# EAGLE design LPC_smd_display_vert (EAGLE 5.03)
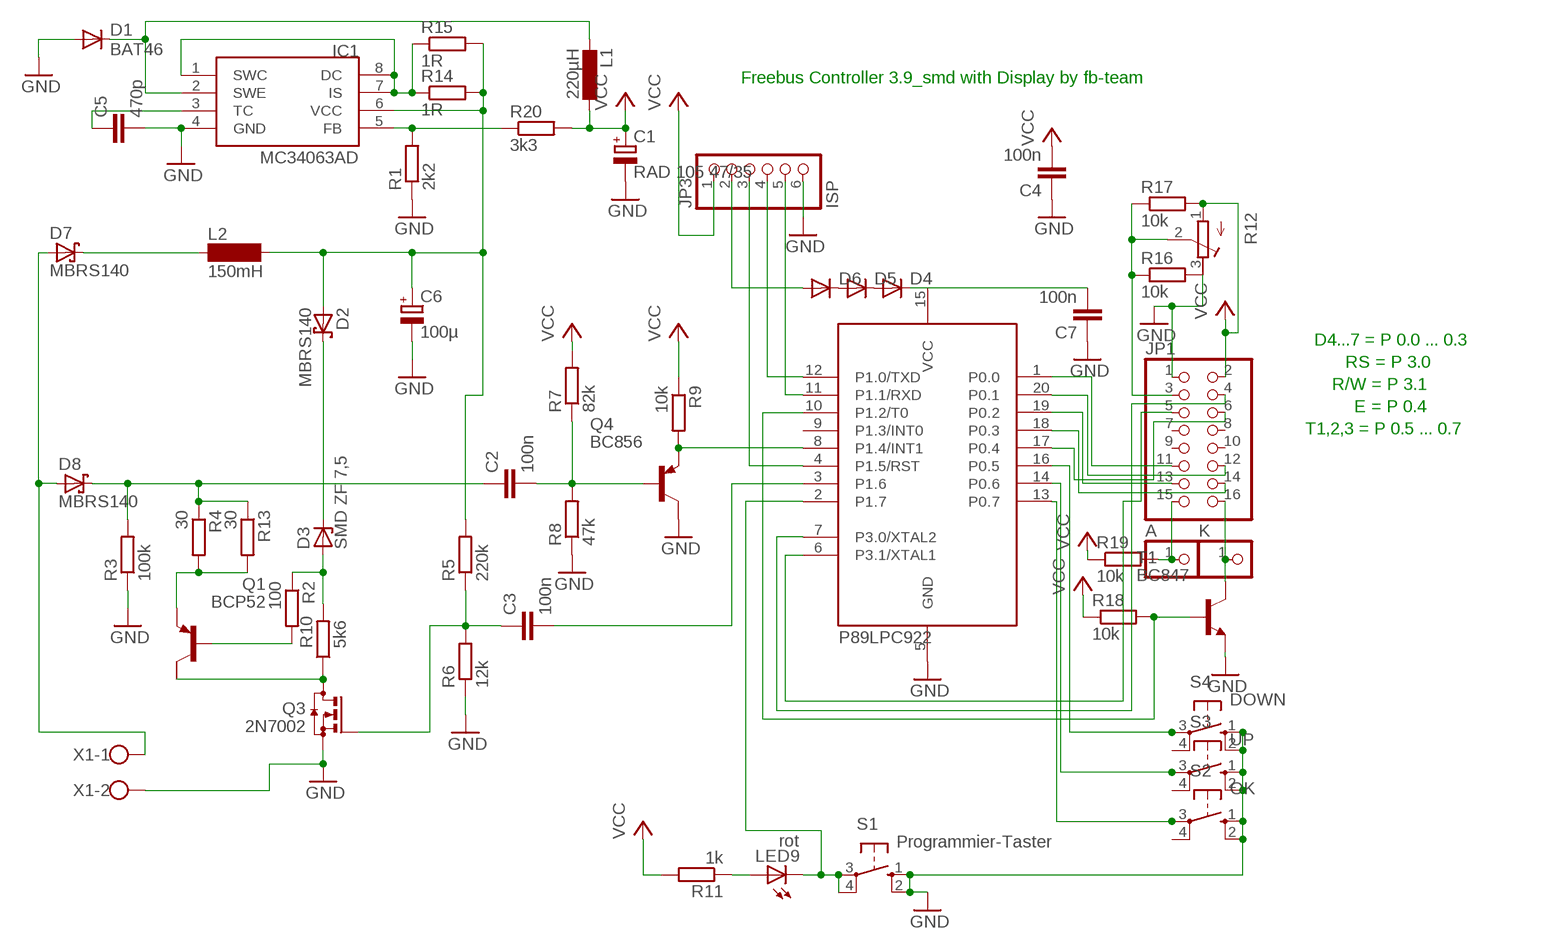
[diagram p0: schematic, sheet 1]

## Parts
A  PINHD-1X1  [1X01]
C1  RAD 105 47/35  CPOL-EUE2-5  [E2-5]
C2  100n  C-EUC1206  [C1206]
C3  100n  C-EUC1206  [C1206]
C4  100n  C-EUC1206  [C1206]
C5  470p  C-EUC1206  [C1206]
C6  100µ  CPOL-EUE2.5-7  [E2,5-7]
C7  100n  C-EUC1206  [C1206]
D1  BAT46  DIODE-MINIMELF  [MINIMELF]
D2  MBRS140  MBRS130LT3  [SMB]
D3  SMD ZF 7,5  ZPD  [MINIMELF]
D4  DIODE-MINIMELF  [MINIMELF]
D5  DIODE-MINIMELF  [MINIMELF]
D6  DIODE-MINIMELF  [MINIMELF]
D7  MBRS140  MBRS130LT3  [SMB]
D8  MBRS140  MBRS130LT3  [SMB]
IC1  MC34063AD  [SOIC8]
JP1  PINHD-2X8  [2X08]
JP3  ISP  PINHD-1X6  [1X06]
K  PINHD-1X1  [1X01]
L1  220µH  L-EU2200-11.43  [2200-11.43]
L2  150mH  SD12-1000  [SD12_1000]
LED9  rot  LED3MM  [LED3MM]
Q1  BCP52  FZT753SMD  [SOT223]
Q3  2N7002  BSS123  [SOT23]
Q4  BC856  BC856ALT1SMD  [SOT23-BEC]
R1  2k2  R-EU_R1206  [R1206]
R2  100  R-EU_M1206  [M1206]
R3  100k  R-EU_M1206  [M1206]
R4  30  R-EU_R1206  [R1206]
R5  220k  R-EU_R1206  [R1206]
R6  12k  R-EU_M1206  [M1206]
R7  82k  R-EU_R1206  [R1206]
R8  47k  R-EU_M1206  [M1206]
R9  10k  R-EU_R1206  [R1206]
R10  5k6  R-EU_M1206  [M1206]
R11  1k  R-EU_M1206  [M1206]
R12  R-TRIMM3374  [RTRIM3374]
R13  30  R-EU_R1206  [R1206]
R14  1R  R-EU_M1206  [M1206]
R15  1R  R-EU_M1206  [M1206]
R16  10k  R-EU_R1206  [R1206]
R17  10k  R-EU_R1206  [R1206]
R18  10k  R-EU_R1206  [R1206]
R19  10k  R-EU_R1206  [R1206]
R20  3k3  R-EU_M1206  [M1206]
S1  Programmier-Taster  10-XX  [B3F-10XX]
S2  OK  10-XX  [B3F-10XX]
S3  UP  10-XX  [B3F-10XX]
S4  DOWN  10-XX  [B3F-10XX]
T1  BC847  [SOT23]
U$1  P89LPC922_SMD  [SO20W]
X1  W237-02P  [W237-132]

## Nets
GND: C1.- C4.1 C5.2 C6.- C7.1 D1.A IC1.4(GND) JP1.1 JP3.6 Q3.2(S) Q4.C R1.1 R3.1 R6.1 R8.1 R12.3(A) R16.2 S1.1(S) S1.2(S1) S2.1(S) S2.2(S1) S3.1(S) S3.2(S1) S4.1(S) S4.2(S1) T1.2(E) U$1.5(GND) X1.2
N$1: Q4.E R9.2 U$1.8(P1.4/INT1)
N$2: C2.2 Q4.B R7.1 R8.2
N$3: IC1.5(FB) R1.2 R20.1
N$4: IC1.1(SWC) IC1.7(IS) IC1.8(DC) R14.1 R15.1
N$5: C3.2 U$1.3(P1.6)
N$6: Q1.2(C) Q3.3(D) R10.1
N$7: C6.+ D2.A IC1.6(VCC) L2.2 R5.2 R14.2 R15.2
N$8: D7.C L2.1
N$9: C2.1 D8.C R3.2 R4.1 R13.1
N$10: D1.C IC1.2(SWE) L1.2
N$11: D3.A R2.1 R10.2
N$12: Q1.3(E) R4.2 R13.2
N$13: C5.1 IC1.3(TC)
N$14: Q1.1(B) R2.2
N$15: JP1.11 U$1.1(P0.0)
N$16: D7.A D8.A X1.1
N$17: LED9.K(C) S1.3(P) S1.4(P1) U$1.2(P1.7)
N$18: JP1.12 U$1.20(P0.1)
N$19: JP1.13 U$1.19(P0.2)
N$20: JP1.3 R12.2(S) R16.1 R17.1
N$21: JP1.14 U$1.18(P0.3)
N$22: JP1.16 K.1 T1.3(C)
N$23: S4.3(P) U$1.16(P0.5)
N$24: R18.2 T1.1(B) U$1.10(P1.2/T0)
N$25: JP1.4 U$1.7(P3.0/XTAL2)
N$26: JP1.5 U$1.6(P3.1/XTAL1)
N$27: JP1.6 U$1.17(P0.4)
N$28: S3.3(P) U$1.14(P0.6)
N$29: JP3.4 U$1.12(P1.0/TXD)
N$30: JP3.5 U$1.11(P1.1/RXD)
N$31: JP3.3 U$1.4(P1.5/RST)
N$32: D6.A JP3.2
N$33: S2.3(P) U$1.13(P0.7)
N$34: C3.1 Q3.1(G) R5.1 R6.2
N$35: C7.2 D4.C U$1.15(VCC)
N$36: A.1 JP1.15 R19.2
N$37: D4.A D5.C
N$38: D5.A D6.C
N$40: D2.C D3.C
N$41: LED9.A R11.1
VCC: C1.+ C4.2 JP1.2 JP3.1 L1.1 R7.2 R9.1 R11.2 R12.1(E) R17.2 R18.1 R19.1 R20.2
Unconnected: JP1.7 JP1.8 JP1.9 JP1.10 Q1.4(C/) S2.4(P1) S3.4(P1) S4.4(P1) U$1.9(P1.3/INT0)

## Notes on the sheet
- Freebus Controller 3.9_smd with Display by fb-team
- D4...7 = P 0.0 ... 0.3
- RS = P 3.0
- R/W = P 3.1
- E = P 0.4
- T1,2,3 = P 0.5 ... 0.7
- P89LPC922

## Library data of the parts
A K = pinhead:PINHD-1X1: PIN HEADER
C1 C6 = rcl:CPOL-EU: POLARIZED CAPACITOR, European symbol
C2-C5 C7 = rcl:C-EU: CAPACITOR, European symbol
D1 D4-D6 = diode:DIODE-: DIODE
D2 D7 D8 = diode:MBRS130LT3: Schottky Power Rectifier Source: http://www.onsemi.com/pub/Collateral/MBRS130LT3-D.PDF
D3 = diode:ZPD: Z DIODE 500 mW
IC1 = mc34063:MC34063
JP1 = pinhead:PINHD-2X8: PIN HEADER
JP3 = pinhead:PINHD-1X6: PIN HEADER
L1 = rcl:L-EU: INDUCTOR, European symbol
L2 = inductor-neosid:SD12: INDUCTOR nominal inductance
LED9 = led:LED: LED OSRAM: - CHIPLED LG R971, LG N971, LY N971, LG Q971, LY Q971, LO R971, LY R971 LH N974, LH R974 LS Q976, LO Q976, LY Q976 LO Q996 - Hyper CHIPLED LW Q18S LB Q993, LB Q99A, LB R99A - SideLED LS A670, LO A670, LY A670, LG A670, LP A670 LB A673, LV A673, LT A673, LW A673 LH A674 LY A675 LS A676, LA A676, LO A676, LY A676, LW A676 LS A679, LY A679, LG A679 - Hyper Micro SIDELED® LS Y876, LA Y876, LO Y876, LY Y876 LT Y87S - SmartLED LW L88C, LW L88S LB L89C, LB L89S, LG L890 LS L89K, LO L89K, LY L89K LS L896, LA L896, LO L896, LY L896 - TOPLED LS T670, LO T670, LY T670, LG T670, LP T670 LSG T670, LSP T670, LSY T670, LOP T670, LYG T670 LG T671, LOG T671, LSG T671 LB T673, LV T673, LT T673, LW T673 LH T674 LS T676, LA T676, LO T676, LY T676, LB T676, LH T676, LSB T676, LW T676 LB T67C, LV T67C, LT T67C, LS T67K, LO T67K, LY T67K, LW E67C LS E67B, LA E67B, LO E67B, LY E67B, LB E67C, LV E67C, LT E67C LW T67C LS T679, LY T679, LG T679 LS T770, LO T770, LY T770, LG T770, LP T770 LB T773, LV T773, LT T773, LW T773 LH T774 LS E675, LA E675, LY E675, LS T675 LS T776, LA T776, LO T776, LY T776, LB T776 LHGB T686 LT T68C, LB T68C - Hyper Mini TOPLED® LB M676 - Mini TOPLED Santana® LG M470 LS M47K, LO M47K, LY M47K Source: http://www.osram.convergy.de - LUMILED® LXK2-PW12-R00, LXK2-PW12-S00, LXK2-PW14-U00, LXK2-PW14-V00 LXK2-PM12-R00, LXK2-PM12-S00, LXK2-PM14-U00 LXK2-PE12-Q00, LXK2-PE12-R00, LXK2-PE12-S00, LXK2-PE14-T00, LXK2-PE14-U00 LXK2-PB12-K00, LXK2-PB12-L00, LXK2-PB12-M00, LXK2-PB14-N00, LXK2-PB14-P00, LXK2-PB14-Q00 LXK2-PR12-L00, LXK2-PR12-M00, LXK2-PR14-Q00, LXK2-PR14-R00 LXK2-PD12-Q00, LXK2-PD12-R00, LXK2-PD12-S00 LXK2-PH12-R00, LXK2-PH12-S00 LXK2-PL12-P00, LXK2-PL12-Q00, LXK2-PL12-R00 Source: www.luxeon.com
Q1 = transistor-pnp:FZT753SMD: PNP Transistor
Q3 = transistor-small-signal:BSS123: N-CHANNEL MOS FET
Q4 = transistor-pnp:BC856*: PNP Transistror
R1-R11 R13-R20 = rcl:R-EU_: RESISTOR, European symbol
R12 = rcl:R-TRIMM: Trimm resistor
S1-S4 = switch-omron:10-XX: OMRON SWITCH
T1 = transistor:BC847: NPN TRANSISTOR
U$1 = micro-philips:P89LPC922_SMD
X1 = con-wago-508:W237-02P: WAGO SREW CLAMP

## Board
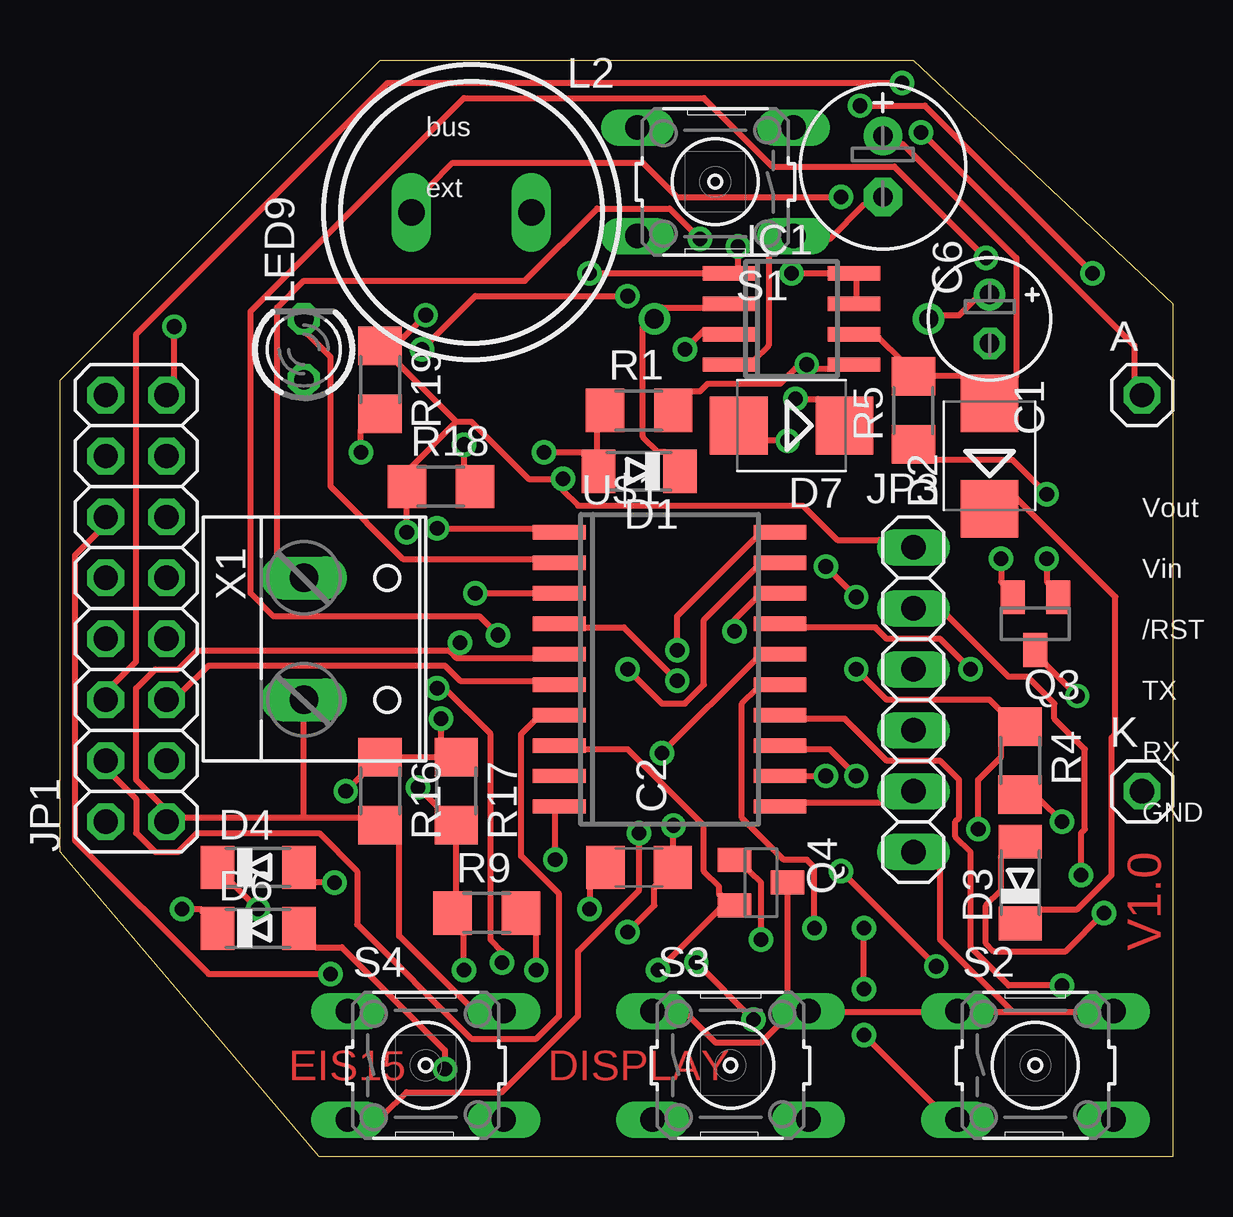
[diagram p1: board, top side]
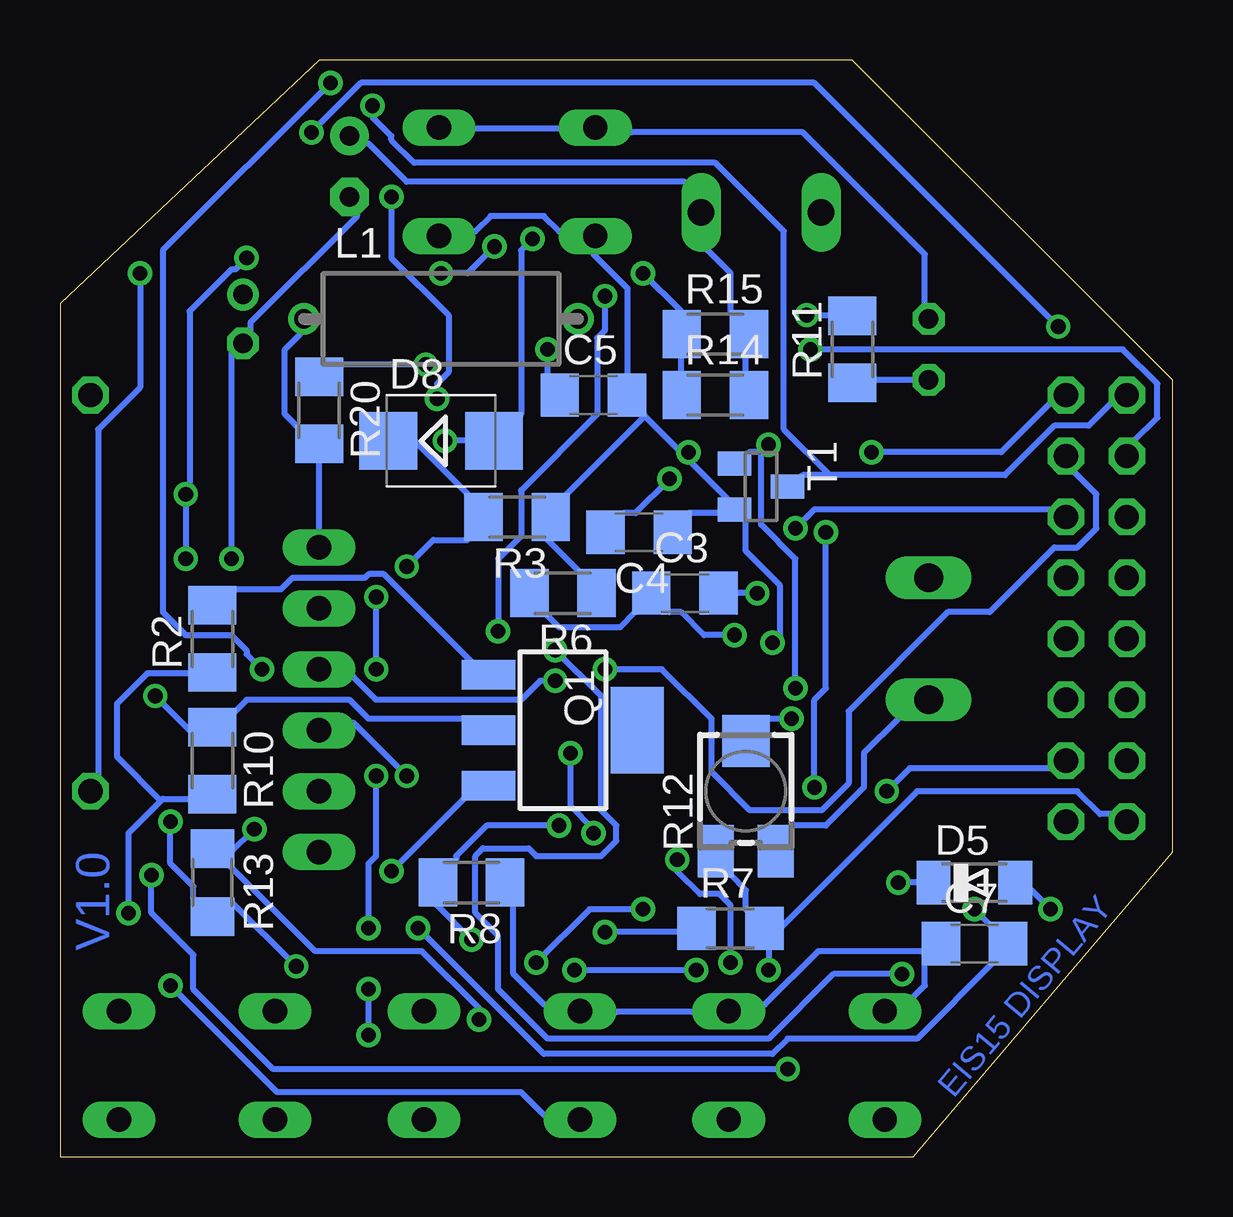
[diagram p2: board, bottom side, seen from below]

Size 46.35 x 45.72 mm. Coordinates in mm from the lower left corner, seen from the top.
Outline: 0,12.7 0,32.39 13.33,45.72 35.56,45.72 46.35,35.56 46.35,0 10.79,0 0,12.7
Copper layers (1*16): Top 0.035mm / dielectric 1.5mm / Bottom 0.035mm
Design rules "default *": minimum track width 10mil, minimum drill 24mil, track to track 10mil, track to pad 10mil, pad to pad 10mil, via to via 10mil, smd to smd 8mil, copper to edge 20mil, drill to drill 8mil, minimum pad ring 10mil, minimum via ring 8mil, stop-mask expansion 4mil, vias tented up to drill 0mil, thermal gap 10mil

### Footprints (pad centres in the part's own frame; a part is rotated, then mirrored left to right if it is on the bottom)
1X01 = drill 1.016 octagon: 1 0,0
E2-5 = drill 0.813 pad 1.27 round: + -1.016,0 | drill 0.813 pad 1.27 octagon: - 1.016,0
C1206 = smd 1.6 x 1.8: 1 -1.4,0; 2 1.4,0
E2,5-7 = drill 0.813 pad 1.6 round: + -1.27,0 | drill 0.813 pad 1.6 octagon: - 1.27,0
MINIMELF = smd 1.4 x 1.8: A 1.7,0; C -1.7,0
SMB = smd 2.4 x 2.4: A 2.2,0; C -2.2,0
SOIC8 = smd 0.6 x 2.2: 1 -1.905,-2.6; 2 -0.635,-2.6; 3 0.635,-2.6; 4 1.905,-2.6; 5 1.905,2.6; 6 0.635,2.6; 7 -0.635,2.6; 8 -1.905,2.6
2X08 = drill 1.016 octagon: 1 -8.89,-1.27; 2 -8.89,1.27; 3 -6.35,-1.27; 4 -6.35,1.27; 5 -3.81,-1.27; 6 -3.81,1.27; 7 -1.27,-1.27; 8 -1.27,1.27; 9 1.27,-1.27; 10 1.27,1.27; 11 3.81,-1.27; 12 3.81,1.27; 13 6.35,-1.27; 14 6.35,1.27; 15 8.89,-1.27; 16 8.89,1.27
1X06 = drill 1.016 long: 1 -6.35,0; 2 -3.81,0; 3 -1.27,0; 4 1.27,0; 5 3.81,0; 6 6.35,0
2200-11.43 = drill 0.8 pad 1.27 round: 1 -5.715,0; 2 5.715,0
SD12_1000 = drill 1.1 long: 1 -2.5,0; 2 2.5,0
LED3MM = drill 0.813 octagon: A -1.27,0; K 1.27,0
SOT223 = smd 1.219 x 2.235: 1 -2.311,-3.099; 2 0,-3.099; 3 2.311,-3.099 | smd 3.6 x 2.2: 4 0,3.099
SOT23 = smd 1 x 1.4: 1 -0.95,-1.1; 2 0.95,-1.1; 3 0,1.1
SOT23-BEC = smd 1 x 1.4: B -0.95,-1.1; C 0,1.1; E 0.95,-1.1
R1206 = smd 1.6 x 1.803: 1 -1.422,0; 2 1.422,0
M1206 = smd 1.6 x 2: 1 -1.4,0; 2 1.4,0
RTRIM3374 = smd 1.5 x 2.2: 1 -1.25,-2.5; 3 1.25,-2.5 | smd 1.98 x 2.17: 2 0,2.1
B3F-10XX = drill 1.016 long: 1 -3.251,2.261; 2 3.251,2.261; 3 -3.251,-2.261; 4 3.251,-2.261
SO20W = smd 0.6 x 2.2: 1 -5.715,-4.6; 2 -4.445,-4.6; 3 -3.175,-4.6; 4 -1.905,-4.6; 5 -0.635,-4.6; 6 0.635,-4.6; 7 1.905,-4.6; 8 3.175,-4.6; 9 4.445,-4.6; 10 5.715,-4.6; 11 5.715,4.6; 12 4.445,4.6; 13 3.175,4.6; 14 1.905,4.6; 15 0.635,4.6; 16 -0.635,4.6; 17 -1.905,4.6; 18 -3.175,4.6; 19 -4.445,4.6; 20 -5.715,4.6
W237-132 = drill 1.194 long: 1 -2.54,-0.635; 2 2.54,-0.635

### Placement (x,y rotation side)
A  45.09,31.75 0 top
C1  38.73,34.93 270 top
C2  24.13,12.06 0 top
C3  20.32,23.49 0 bottom
C4  22.23,26.03 180 bottom
C5  24.13,31.75 0 bottom
C6  34.29,41.27 270 top
C7  8.26,8.89 0 bottom
D1  24.13,28.58 180 top
D2  38.73,29.21 90 top
D3  40,11.43 90 top
D4  8.26,12.06 0 top
D5  8.26,11.43 0 bottom
D6  8.26,9.53 0 top
D7  30.48,30.48 180 top
D8  30.48,29.84 0 bottom
IC1  30.48,34.93 270 top
JP1  3.17,22.86 90 top
JP3  35.56,19.05 270 top
K  45.09,15.24 0 top
L1  30.48,34.93 0 bottom
L2  17.15,39.37 0 top
LED9  10.16,33.66 90 top
Q1  25.4,17.78 270 bottom
Q3  40.64,22.23 180 top
Q4  29.21,11.43 270 top
R1  24.13,31.12 0 top
R2  40,21.59 90 bottom
R3  27.31,26.67 180 bottom
R4  40,16.51 270 top
R5  35.56,31.12 90 top
R6  25.4,23.49 180 bottom
R7  18.42,9.53 0 bottom
R8  29.21,11.43 180 bottom
R9  17.78,10.16 0 top
R10  40,16.51 270 bottom
R11  13.33,33.66 90 bottom
R12  17.78,15.24 0 bottom
R13  40,11.43 270 bottom
R14  19.05,31.75 0 bottom
R15  19.05,34.29 0 bottom
R16  13.33,15.24 270 top
R17  16.51,15.24 270 top
R18  15.88,27.94 0 top
R19  13.33,32.39 270 top
R20  35.56,31.12 270 bottom
S1  27.31,40.64 180 top
S2  40.64,3.81 0 top
S3  27.94,3.81 0 top
S4  15.24,3.81 0 top
T1  17.15,27.94 270 bottom
U$1  25.4,20.32 270 top
X1  10.79,21.59 270 top

### Tracks (layer width: path | path; a pad name or v marks a point on that pad's centre or on a via)
GND  (via drill 0.61)
  Top 0.254: R1.1 22.38,30.32 22.38,29.37 D1.A 21.75,29.37 v20.16,29.37 | v39.21,24.92 39.21,23.97 Q3.2 | IC1.4 28.89,33.18 29.53,33.81 29.53,37.62 S1.1 32.07,38.26 33.5,39.69 C6.- | 10.16,14.13 5.08,14.13 JP1.1 4.29,14.6 3.17,15.72 3.17,19.53 3.97,20.32 4.92,20.32 5.71,21.11 16.19,21.11 16.27,21.03 | 10.16,14.13 12.54,14.13 R16.2 14.13,13.18 14.13,9.21 16.99,6.35 S4.2 | 16.27,21.03 16.51,20.8 19.84,20.8 U$1.5 | 10.16,14.13 10.16,18.26 X1.2 | Q4.C 30.32,10.95 30.32,6.83 S3.2 | S3.2 32.7,6.03 35.88,6.03 S2.1 38.89,6.03 39.69,6.03 | 39.69,6.03 42.39,6.03 S2.2 | 39.69,6.03 36.67,9.05 36.67,12.06 JP3.6 | S3.2 30,5.56 29.21,4.76 27.31,4.76 26.19,5.87 S3.1 | v16.67,21.43 16.35,21.11 16.27,21.03
  Bottom 0.254: R6.1 24.77,24.45 26.04,25.72 R3.1 25.24,27.62 22.07,30.8 21.99,30.88 | T1.2 18.89,26.83 20.16,26.83 C4.1 | 20.4,29.29 18.57,27.46 T1.2 | 20.4,29.29 21.99,30.88 | 21.99,30.88 22.07,30.96 C5.2 22.7,32.54 22.7,36.2 24.13,37.62 S1.2 25.56,38.58 26.19,39.21 28.42,39.21 29.05,38.58 S1.1 | v20.16,29.37 20.32,29.37 20.4,29.29 | v39.21,24.92 39.21,33.5 C1.- 38.42,34.45 38.42,34.77 33.97,39.21 C6.- | R12.3 15.88,13.81 14.45,13.81 12.86,15.4 12.86,16.83 11.43,18.26 X1.2 | S4.1 10.79,6.67 10.32,7.14 10.32,8.1 C7.1 10.32,8.57 14.76,8.57 16.99,6.35 S4.2 20,6.03 23.18,6.03 S3.1 26.19,6.35 27.46,7.62 27.46,10.48 R8.1 | v16.67,21.43 16.35,21.75 16.35,23.81 17.78,25.24 17.78,26.51 T1.2
N$1  (via drill 0.61)
  Top 0.254: U$1.8 21.75,16.99 23.65,16.99 26.83,13.81 26.83,11.91 27.46,11.27 27.46,10.95 Q4.E 27.46,10.32 v24.92,7.78 | v19.84,7.78 19.84,9.37 R9.2
  Bottom 0.254: v19.84,7.78 v24.92,7.78
N$2  (via drill 0.61)
  Top 0.254: v29.21,9.05 29.21,11.43 28.73,11.91 Q4.B | v23.65,9.37 24.77,10.48 24.77,11.27 C2.2 25.56,12.86 v25.56,13.81
  Bottom 0.254: v29.21,9.05 30.64,10.48 R8.2 29.85,12.38 29.85,12.54 28.58,13.81 v25.56,13.81 | v23.65,9.37 20.48,9.37 R7.1
N$3  (via drill 0.61)
  Top 0.254: 31.12,32.86 32.07,32.86 IC1.5 | 31.12,32.86 30.64,32.86 30,32.23 26.99,32.23 26.67,31.91 26.19,31.91 R1.2 | 31.12,32.86 v31.12,33.02
  Bottom 0.254: v31.12,33.02 34.61,33.02 R20.1
N$4  (via drill 0.61)
  Top 0.254: IC1.7 33.18,35.72 33.18,36.67 IC1.8 32.07,36.83 v30.48,36.83 | v22.07,36.83 26.83,36.83 IC1.1 28.26,36.99 v28.26,37.94
  Bottom 0.254: R14.1 20.48,32.7 20.48,33.34 R15.1 20.48,35.24 v22.07,36.83 | v30.48,36.83 29.37,36.83 v28.26,37.94
N$5  (via drill 0.61)
  Top 0.254: v17.3,23.49 19.84,23.49 U$1.3
  Bottom 0.254: v17.3,23.49 18.26,23.49 C3.2
N$6  (via drill 0.61)
  Top 0.254: v42.39,19.21 41.12,20.48 Q3.3
  Bottom 0.254: v42.39,19.21 40.96,17.78 R10.1 39.05,18.57 38.58,19.05 34.29,19.05 33.5,18.26 29.53,18.26 Q1.2
N$7
  Top 0.254: IC1.6 34.13,34.13 35.08,33.18 R5.2 36.35,32.54 37.62,32.54 D2.A 39.85,32.54 39.85,37.47 35.08,42.23 C6.+
  Bottom 0.254: R14.2 17.78,32.7 17.78,33.34 R15.2 18.42,35.24 18.42,36.83 19.37,37.78 L2.2 20.32,40.64 31.91,40.64 33.5,42.23 C6.+
N$8  (via drill 0.61)
  Top 0.254: v30.64,31.59 31.59,31.59 D7.C | v32.54,40.01 25.72,40.01 24.29,41.43 16.35,41.43 15.4,40.48 L2.1
  Bottom 0.254: v30.64,31.59 30.64,32.23 30.16,32.7 30.16,35.08 32.54,37.47 v32.54,40.01
N$9  (via drill 0.61)
  Top 0.254: v22.07,10.32 22.07,11.27 C2.1 | v26.51,8.1 v28.89,5.71 | v38.26,13.65 38.26,15.72 39.21,16.67 39.21,17.15 R4.1 39.21,18.57 38.73,19.05 34.45,19.05 v33.18,20.32 | v33.18,23.34 v31.91,24.61
  Bottom 0.254: D8.C 31.59,29.84 29.37,27.62 R3.2 29.37,25.72 30.8,25.72 v31.91,24.61 | v22.07,10.32 24.29,10.32 v26.51,8.1 | v28.89,5.71 28.89,6.19 31.27,8.57 35.72,8.57 39.21,12.06 R13.1 39.21,12.7 v38.26,13.65 | v33.18,20.32 v33.18,23.34
N$10
  Top 0.254: D1.C 25.24,29.37 24.92,29.37 24.29,30 24.29,34.61 L1.2 25.08,35.4 26.83,35.4 IC1.2
N$11  (via drill 0.61)
  Top 0.254: v43.5,10.16 41.91,8.57 38.89,8.57 38.58,8.89 38.58,10.48 39.21,11.11 39.21,12.54 D3.A
  Bottom 0.254: v43.5,10.16 43.5,13.49 42.15,14.84 | 42.15,14.84 42.07,14.92 40.96,14.92 R10.2 | R2.1 40.96,20.16 42.7,20.16 43.97,18.89 43.97,16.67 42.15,14.84
N$12  (via drill 0.61)
  Top 0.254: v41.75,13.97 40.8,14.92 R4.2 | v32.54,11.91 v36.51,7.94
  Bottom 0.254: v41.75,13.97 41.75,12.22 40.8,11.27 40.8,10.79 R13.2 39.21,10.64 v36.51,7.94 | v32.54,11.91 29.53,14.92 Q1.3
N$13  (via drill 0.61)
  Top 0.254: v26.04,33.66 26.83,34.45 IC1.3
  Bottom 0.254: v26.04,33.66 26.04,32.54 C5.1
N$14
  Bottom 0.254: R2.2 39.05,23.65 37.15,23.65 36.67,24.13 33.66,24.13 33.5,24.29 32.86,24.29 29.21,20.64 Q1.1
N$15  (via drill 0.61)
  Top 0.254: v15.72,26.19 19.84,26.19 U$1.1
  Bottom 0.254: v15.72,26.19 14.92,26.99 5.08,26.99 JP1.11
N$16  (via drill 0.61)
  Top 0.254: v30.32,29.84 29.37,29.84 D7.A | v26.67,38.26 25.4,39.53 22.38,39.53 19.37,36.51 10.16,36.51 9.05,35.4 9.05,24.92 X1.1
  Bottom 0.254: v30.32,29.84 29.37,29.84 D8.A 27.15,30.96 27.15,37.78 v26.67,38.26
N$17
  Top 0.254: U$1.2 19.84,24.92 14.29,24.92 11.27,27.94 11.27,33.34 10.32,34.29 LED9.K
  Bottom 0.254: S1.3 29.05,42.86 25.56,42.86 S1.4 22.54,42.7 15.4,42.7 10.32,37.62 10.32,35.56 LED9.K
N$18  (via drill 0.61)
  Top 0.254: v25.72,21.11 25.72,22.54 29.05,25.88 U$1.20 | v11.27,7.62 6.19,7.62 0.64,13.18 0.64,25.08 1.59,26.03 JP1.12
  Bottom 0.254: v25.72,21.11 23.81,19.21 23.81,14.45 23.18,13.81 23.18,13.18 23.81,12.54 26.51,12.54 26.83,12.86 28.73,12.86 29.05,12.54 29.05,10.16 28.1,9.21 28.1,6.98 26.04,4.92 16.83,4.92 14.13,7.62 v11.27,7.62
N$19  (via drill 0.61)
  Top 0.254: v23.65,20.32 25.08,18.89 26.04,18.89 26.83,19.69 26.83,22.38 29.05,24.61 U$1.19
  Bottom 0.254: v23.65,20.32 21.27,20.32 19.21,18.26 19.21,16.03 17.62,14.45 14.61,14.45 13.49,15.56 13.49,18.57 9.37,22.7 7.62,22.7 4.92,25.4 3.97,25.4 3.17,26.19 3.17,27.62 4.13,28.58 JP1.13
N$20  (via drill 0.61)
  Top 0.254: v15.88,18.26 15.88,17.3 R17.1 15.72,16.67 14.13,16.67 R16.1 12.54,15.87 v11.91,15.24
  Bottom 0.254: v15.88,18.26 16.83,18.26 R12.2 | v11.91,15.24 10.95,16.19 5.08,16.19 JP1.3
N$21  (via drill 0.61)
  Top 0.254: v28.1,21.91 28.1,22.38 29.05,23.34 U$1.18 | v23.65,35.88 17.3,35.88 v15.08,33.66
  Bottom 0.254: v28.1,21.91 28.1,24.92 27.15,25.88 27.15,27.78 23.97,30.96 23.97,34.13 23.65,34.45 v23.65,35.88 | v15.08,33.66 2.06,33.66 0.64,32.23 0.64,30.8 1.59,29.84 JP1.14
N$22  (via drill 0.61)
  Top 0.254: v43.02,36.83 36.04,43.82 v33.34,43.82
  Bottom 0.254: 14.29,28.42 6.98,28.42 4.92,30.48 3.49,30.48 2.54,31.43 JP1.16 | 14.29,28.42 15.4,28.42 T1.3 | v43.02,36.83 43.02,32.07 44.77,30.32 44.77,15.87 K.1 | v33.34,43.82 33.34,43.34 32.54,42.55 32.54,42.39 31.59,41.43 19.05,41.43 16.19,38.58 16.19,30.32 14.29,28.42
N$23  (via drill 0.61)
  Top 0.254: v25.08,16.83 29.05,20.8 U$1.16 | v24.13,13.49 24.13,11.11 21.59,8.57 21.59,5.87 18.42,2.7 14.45,2.7 13.49,1.75 S4.3
  Bottom 0.254: v25.08,16.83 25.08,14.6 24.13,13.65 v24.13,13.49
N$24  (via drill 0.61)
  Top 0.254: v16.83,29.69 16.83,28.73 R18.2 | v20.64,12.38 20.64,14.45 U$1.10 | v18.42,8.1 18.42,8.57 17.94,9.05 17.94,17.62 16.03,19.53 v15.72,19.53
  Bottom 0.254: 17.15,29.37 17.62,29.37 T1.1 | v20.64,12.38 20.64,11.91 19.69,10.95 18.89,10.95 18.42,10.48 v18.42,8.1 | v15.72,19.53 15.72,24.92 17.15,26.35 17.15,29.37 | 17.15,29.37 v16.83,29.69
N$25
  Top 0.254: U$1.7 19.84,18.26 19.21,17.62 19.21,12.54 20.8,10.95 20.8,5.87 19.84,4.92 17.15,4.92 12.38,9.68 12.38,11.91 10.79,13.49 5.71,13.49 4.92,12.7 3.97,12.7 3.17,13.49 3.17,14.92 2.22,15.87 JP1.4
N$26
  Top 0.254: U$1.6 19.84,19.84 16.67,19.84 16.03,20.48 6.19,20.48 5.08,19.37 JP1.5
N$27  (via drill 0.61)
  Top 0.254: v37.94,20.32 36.67,21.59 34.45,21.59 33.97,22.07 30.96,22.07 U$1.17 | v35.08,44.77 13.65,44.77 3.17,34.29 3.17,20.64 2.22,19.69 JP1.6
  Bottom 0.254: v37.94,20.32 38.58,20.95 38.58,21.11 39.21,21.75 41.12,21.75 42.07,22.7 42.07,37.78 v35.08,44.77
N$28  (via drill 0.61)
  Top 0.254: v41.75,7.14 39.53,7.14 37.94,8.73 37.94,12.7 37.31,13.33 37.31,13.97 37.46,14.13 37.46,15.72 36.67,16.51 34.45,16.51 32.7,18.26 30.96,18.26 U$1.14
  Bottom 0.254: v41.75,7.14 37.31,2.7 27.15,2.7 26.19,1.75 S3.3
N$29  (via drill 0.61)
  Top 0.254: v31.91,15.87 30.96,15.87 U$1.12
  Bottom 0.254: v31.91,15.87 34.13,18.1 JP3.4
N$30
  Top 0.254: U$1.11 30.96,14.76 34.29,14.76 JP3.5
N$31  (via drill 0.61)
  Top 0.254: v25.72,19.84 23.5,22.07 21.75,22.07 U$1.4
  Bottom 0.254: v25.72,19.84 26.35,19.84 27.15,19.05 33.18,19.05 34.13,20 JP3.3
N$32  (via drill 0.61)
  Top 0.254: v16.03,3.65 16.03,4.45 11.75,8.73 10.64,8.73 D6.A | v42.54,11.75 42.54,13.49 42.7,13.65 42.7,16.99 41.43,18.26 41.43,18.89 40.32,20 39.53,20 36.99,22.54 JP3.2
  Bottom 0.254: v16.03,3.65 37.46,3.65 40.8,6.98 40.8,8.41 42.54,10.16 v42.54,11.75
N$33  (via drill 0.61)
  Top 0.254: v33.18,15.87 32.07,16.99 30.96,16.99 U$1.13 | v33.5,6.98 v33.5,9.53 | v33.5,5.08 36.35,2.22 S2.3
  Bottom 0.254: v33.18,15.87 33.18,12.54 33.5,12.22 v33.5,9.53 | v33.5,5.08 v33.5,6.98
N$34  (via drill 0.61)
  Top 0.254: v41.12,24.92 41.12,23.97 Q3.1 | v41.12,27.62 39.69,29.05 36.35,29.05 R5.1 | v18.26,21.75 17.46,22.54 8.89,22.54 7.94,23.49 7.94,35.24 16.83,44.13 26.83,44.13 29.69,41.27 34.77,41.27 v38.58,37.47
  Bottom 0.254: R6.2 26.04,22.54 25.56,22.07 23.02,22.07 22.38,22.7 C3.1 20.96,22.7 20.48,22.7 19.53,21.75 v18.26,21.75 | v41.12,24.92 v41.12,27.62 40.96,28.1 40.96,35.24 39.21,36.99 39.05,36.99 v38.58,37.47
N$35  (via drill 0.61)
  Top 0.254: v8.26,10.32 7.14,11.43 D4.C | v31.43,9.53 31.43,12.06 31.12,12.38 30.16,12.38 28.42,14.13 28.42,18.89 29.05,19.53 U$1.15
  Bottom 0.254: v8.26,10.32 7.62,9.68 C7.2 7.46,8.1 10.64,4.92 16.03,4.92 16.67,4.29 26.19,4.29 v31.43,9.53
N$36  (via drill 0.61)
  Top 0.254: v12.54,29.37 12.54,30.32 R19.2 | v35.88,42.7 44.77,33.81 44.77,32.39 A.1 | v4.76,34.61 4.76,32.39 JP1.15
  Bottom 0.254: v12.54,29.37 7.14,29.37 5.08,31.43 JP1.15 | v35.88,42.7 33.81,44.77 14.92,44.77 v4.76,34.61
N$37  (via drill 0.61)
  Top 0.254: v11.43,11.43 10.64,11.43 D4.A
  Bottom 0.254: v11.43,11.43 10.64,11.43 D5.C
N$38  (via drill 0.61)
  Top 0.254: v5.08,10.32 5.87,10.32 D6.C
  Bottom 0.254: v5.08,10.32 5.87,11.11 D5.A
N$40
  Top 0.254: D3.C 40.8,10.32 42.39,10.32 43.81,11.75 43.81,17.46 43.97,17.62 43.97,23.34 39.85,27.46 D2.C
N$41
  Bottom 0.254: R11.1 12.38,32.39 10.79,32.39 LED9.A
VCC  (via drill 0.61)
  Top 0.254: v16.83,7.78 16.83,9.37 R9.1 16.51,10.95 16.51,13.18 R17.2 15.72,14.6 v14.92,15.4 | L1.1 36.83,35.08 37.46,35.08 38.1,35.72 C1.+ | 16.51,30.64 17.15,30.64 19.53,28.26 v20.96,28.26 20.96,27.78 21.59,27.15 30.96,27.15 32.38,25.72 34.13,25.72 JP3.1 | 16.51,30.64 14.61,28.73 R18.1 14.45,27.15 v14.45,26.03 | 16.51,30.64 14.13,33.02 R19.1 14.13,33.97 v15.24,35.08
  Bottom 0.254: R7.2 17.78,10.32 17.78,11.11 18.42,11.75 R12.1 | JP1.2 2.54,14.29 3.02,14.29 3.97,15.24 10.64,15.24 16.35,9.53 R7.2 | v16.83,7.78 16.83,8.73 R7.2 | JP3.1 35.56,26.03 35.56,29.05 R20.2 36.51,30.48 36.99,30.96 36.99,33.66 36.35,34.29 L1.1 | v20.96,28.26 22.38,26.83 22.86,26.83 C4.2 | v15.24,35.08 14.29,35.08 R11.2 | v14.92,15.4 14.92,19.05 14.45,19.53 v14.45,26.03

### Text on the board
Top: V1.0 | EIS15 | DISPLAY
Bottom: V1.0 | EIS15 DISPLAY
tPlace: bus | ext | Vout | Vin | /RST | TX | RX | GND